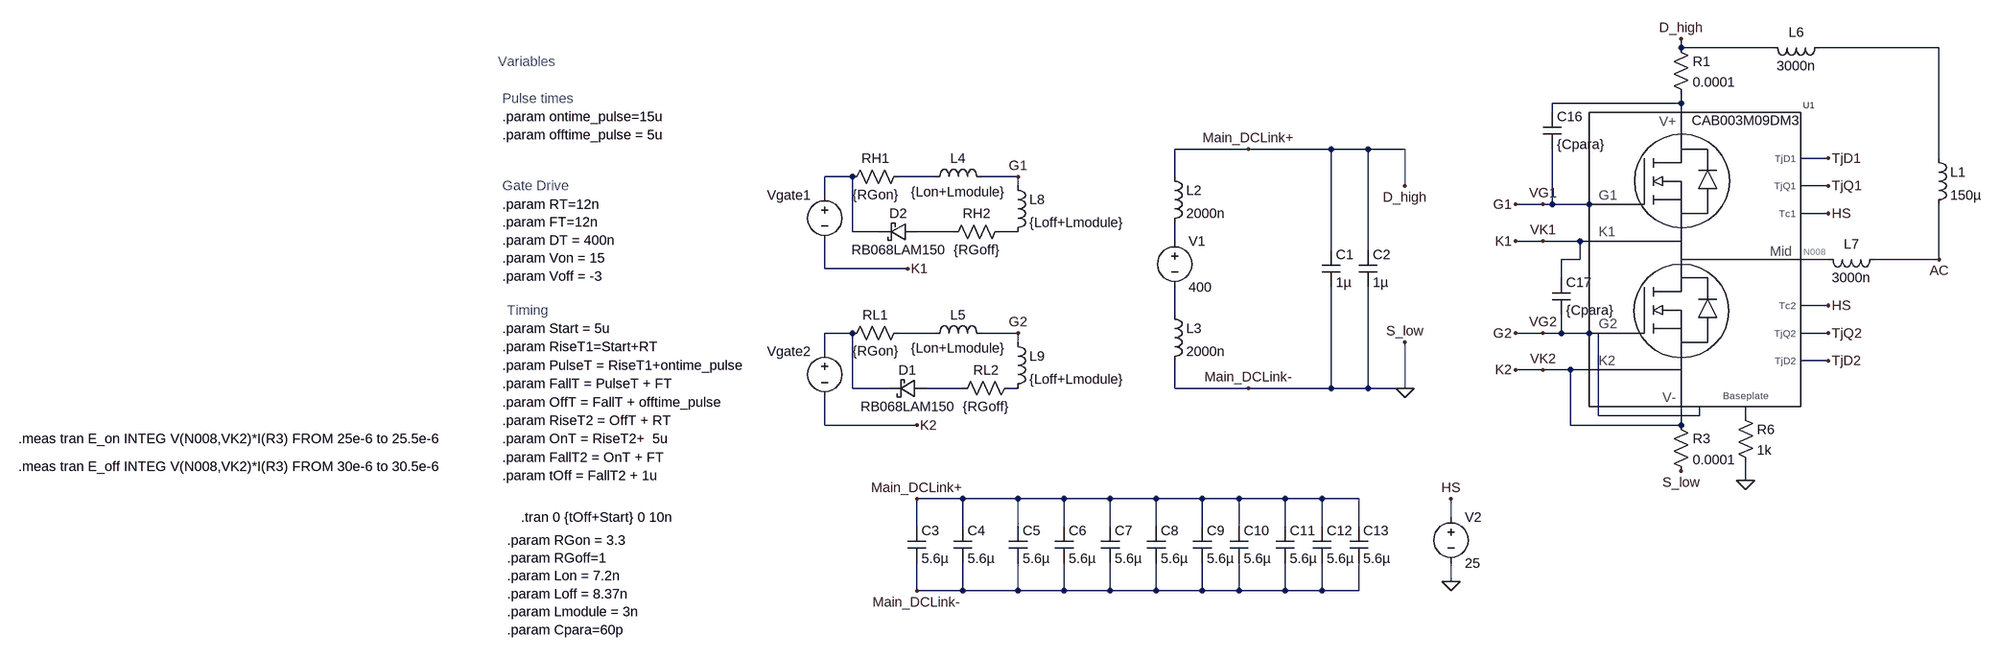
[diagram p0: schematic Inverter_DP.asc]
Inverter_DP.asc, the LTspice schematic file:
Version 4
SHEET 1 10008 968
WIRE 1088 -592 1088 -608
WIRE 1248 -592 1088 -592
WIRE 1536 -592 1328 -592
WIRE 1088 -496 1088 -512
WIRE 1088 -496 864 -496
WIRE 864 -480 864 -496
WIRE 1088 -480 1088 -496
WIRE 336 -416 208 -416
WIRE 480 -416 336 -416
WIRE 544 -416 480 -416
WIRE 608 -416 544 -416
WIRE 1344 -400 1296 -400
WIRE 1536 -400 1536 -592
WIRE -352 -368 -400 -368
WIRE -208 -368 -272 -368
WIRE -64 -368 -128 -368
WIRE 208 -368 208 -416
WIRE -64 -352 -64 -368
WIRE 608 -352 608 -416
WIRE 1344 -352 1296 -352
WIRE -400 -336 -400 -368
WIRE 848 -320 800 -320
WIRE 864 -320 864 -416
WIRE 864 -320 848 -320
WIRE 928 -320 864 -320
WIRE 960 -320 928 -320
WIRE 1344 -304 1296 -304
WIRE -352 -272 -352 -368
WIRE -304 -272 -352 -272
WIRE -176 -272 -240 -272
WIRE -64 -272 -96 -272
WIRE 208 -256 208 -288
WIRE 848 -256 800 -256
WIRE 912 -256 848 -256
WIRE 928 -256 912 -256
WIRE 480 -240 480 -416
WIRE 544 -240 544 -416
WIRE 912 -224 912 -256
WIRE 912 -224 880 -224
WIRE 1344 -224 1296 -224
WIRE 1536 -224 1536 -320
WIRE 1536 -224 1424 -224
WIRE -400 -208 -400 -256
WIRE -256 -208 -400 -208
WIRE 880 -192 880 -224
WIRE 1344 -144 1296 -144
WIRE 208 -128 208 -176
WIRE -352 -96 -400 -96
WIRE -208 -96 -272 -96
WIRE -64 -96 -128 -96
WIRE 848 -96 800 -96
WIRE 880 -96 880 -128
WIRE 880 -96 848 -96
WIRE 928 -96 880 -96
WIRE 944 -96 928 -96
WIRE 1344 -96 1296 -96
WIRE -64 -80 -64 -96
WIRE -400 -64 -400 -96
WIRE 1344 -48 1296 -48
WIRE 848 -32 800 -32
WIRE 896 -32 848 -32
WIRE 928 -32 896 -32
WIRE -352 0 -352 -96
WIRE -288 0 -352 0
WIRE -160 0 -224 0
WIRE -64 0 -80 0
WIRE 208 0 208 -48
WIRE 336 0 208 0
WIRE 480 0 480 -176
WIRE 480 0 336 0
WIRE 544 0 544 -176
WIRE 544 0 480 0
WIRE 608 0 608 -80
WIRE 608 0 544 0
WIRE 944 48 944 -96
WIRE 1120 48 1120 32
WIRE 1120 48 944 48
WIRE 1200 48 1200 32
WIRE -400 64 -400 16
WIRE -240 64 -400 64
WIRE 896 64 896 -32
WIRE 1088 64 1088 32
WIRE 1088 64 896 64
WIRE 1200 160 1200 128
WIRE -160 192 -240 192
WIRE -64 192 -160 192
WIRE 16 192 -64 192
WIRE 96 192 16 192
WIRE 176 192 96 192
WIRE 256 192 176 192
WIRE 320 192 256 192
WIRE 400 192 320 192
WIRE 464 192 400 192
WIRE 528 192 464 192
WIRE 688 224 688 192
WIRE -240 240 -240 192
WIRE -160 240 -160 192
WIRE -64 240 -64 192
WIRE 16 240 16 192
WIRE 96 240 96 192
WIRE 176 240 176 192
WIRE 256 240 256 192
WIRE 320 240 320 192
WIRE 400 240 400 192
WIRE 464 240 464 192
WIRE 528 240 528 192
WIRE 688 336 688 304
WIRE -240 352 -240 304
WIRE -160 352 -160 304
WIRE -160 352 -240 352
WIRE -64 352 -64 304
WIRE -64 352 -160 352
WIRE 16 352 16 304
WIRE 16 352 -64 352
WIRE 96 352 96 304
WIRE 96 352 16 352
WIRE 176 352 176 304
WIRE 176 352 96 352
WIRE 256 352 256 304
WIRE 256 352 176 352
WIRE 320 352 320 304
WIRE 320 352 256 352
WIRE 400 352 400 304
WIRE 400 352 320 352
WIRE 464 352 464 304
WIRE 464 352 400 352
WIRE 528 352 528 304
WIRE 528 352 464 352
FLAG 848 -320 VG1
FLAG 848 -96 VG2
FLAG -64 -368 G1
FLAG -64 -96 G2
FLAG -256 -208 K1
FLAG -240 64 K2
FLAG 800 -320 G1
FLAG 800 -96 G2
FLAG 848 -256 VK1
FLAG 848 -32 VK2
FLAG 800 -256 K1
FLAG 800 -32 K2
FLAG 1344 -352 TjQ1
FLAG 688 192 HS
FLAG 688 336 0
FLAG 1344 -144 HS
FLAG 1344 -304 HS
FLAG 1344 -96 TjQ2
FLAG 1344 -400 TjD1
FLAG 1344 -48 TjD2
FLAG 1200 160 0
FLAG 608 -80 S_low
FLAG 608 -352 D_high
FLAG 608 0 0
FLAG 1088 -608 D_high
FLAG 1088 144 S_low
FLAG 1536 -224 AC
FLAG -240 192 Main_DCLink+
FLAG -240 352 Main_DCLink-
FLAG 336 -416 Main_DCLink+
FLAG 336 0 Main_DCLink-
SYMBOL ind 1520 -416 R0
SYMATTR InstName L1
SYMATTR Value 150µ
SYMBOL res -256 -112 R90
WINDOW 0 0 56 VBottom 2
WINDOW 3 32 56 VTop 2
SYMATTR InstName RL1
SYMATTR Value {RGon}
SYMBOL res -256 -384 R90
WINDOW 0 0 56 VBottom 2
WINDOW 3 32 56 VTop 2
SYMATTR InstName RH1
SYMATTR Value {RGon}
SYMBOL voltage -400 -80 M0
WINDOW 123 0 0 Left 2
WINDOW 39 24 44 Left 2
WINDOW 3 -1448 60 Invisible 2
SYMATTR Value PWL(0u {Voff} {Start} {Voff} {RiseT1} {Von} {PulseT} {Von} {FallT} {Voff} {offT} {Voff} {RiseT2} {Von} {OnT} {Von} {FallT2} {Voff})
SYMATTR InstName Vgate2
SYMBOL voltage 208 -272 R0
WINDOW 123 0 0 Left 0
WINDOW 39 0 0 Left 0
SYMATTR InstName V1
SYMATTR Value 400
SYMBOL voltage 688 208 R0
SYMATTR InstName V2
SYMATTR Value 25
SYMBOL res 1184 32 R0
SYMATTR InstName R6
SYMATTR Value 1k
SYMBOL voltage -400 -352 M0
WINDOW 123 0 0 Left 2
WINDOW 39 24 44 Left 2
WINDOW 3 -1448 60 Invisible 2
SYMATTR Value PWL(0u {Voff} {Start+ontime_pulse+DT} {Voff} {FallT+DT} {Von} {RiseT2-DT} {Von} {RiseT2-DT+FT} {Voff} {FallT2+DT} {Voff} {FallT2+DT+RT} {Von})
SYMATTR InstName Vgate1
SYMBOL cap -256 240 R0
SYMATTR InstName C3
SYMATTR Value 5.6µ
SYMATTR SpiceLine V=500 Irms=6.8 Rser=12.7m Lser=17n
SYMBOL cap -176 240 R0
SYMATTR InstName C4
SYMATTR Value 5.6µ
SYMATTR SpiceLine V=500 Irms=6.8 Rser=12.7m Lser=17n
SYMBOL cap -80 240 R0
SYMATTR InstName C5
SYMATTR Value 5.6µ
SYMATTR SpiceLine V=500 Irms=6.8 Rser=12.7m Lser=17n
SYMBOL cap 0 240 R0
SYMATTR InstName C6
SYMATTR Value 5.6µ
SYMATTR SpiceLine V=500 Irms=6.8 Rser=12.7m Lser=17n
SYMBOL cap 80 240 R0
SYMATTR InstName C7
SYMATTR Value 5.6µ
SYMATTR SpiceLine V=500 Irms=6.8 Rser=12.7m Lser=17n
SYMBOL cap 160 240 R0
SYMATTR InstName C8
SYMATTR Value 5.6µ
SYMATTR SpiceLine V=500 Irms=6.8 Rser=12.7m Lser=17n
SYMBOL cap 240 240 R0
SYMATTR InstName C9
SYMATTR Value 5.6µ
SYMATTR SpiceLine V=500 Irms=6.8 Rser=12.7m Lser=17n
SYMBOL cap 304 240 R0
SYMATTR InstName C10
SYMATTR Value 5.6µ
SYMATTR SpiceLine V=500 Irms=6.8 Rser=12.7m Lser=17n
SYMBOL cap 384 240 R0
SYMATTR InstName C11
SYMATTR Value 5.6µ
SYMATTR SpiceLine V=500 Irms=6.8 Rser=12.7m Lser=17n
SYMBOL cap 448 240 R0
SYMATTR InstName C12
SYMATTR Value 5.6µ
SYMATTR SpiceLine V=500 Irms=6.8 Rser=12.7m Lser=17n
SYMBOL cap 512 240 R0
SYMATTR InstName C13
SYMATTR Value 5.6µ
SYMATTR SpiceLine V=500 Irms=6.8 Rser=12.7m Lser=17n
SYMBOL cap 464 -240 R0
SYMATTR InstName C1
SYMATTR Value 1µ
SYMATTR SpiceLine V=500 Irms=11.4 Rser=120m Lser=2.5n
SYMBOL cap 528 -240 R0
SYMATTR InstName C2
SYMATTR Value 1µ
SYMATTR SpiceLine V=500 Irms=11.4 Rser=120m Lser=2.5n
SYMBOL ind 192 -384 R0
SYMATTR InstName L2
SYMATTR Value 2000n
SYMBOL ind 192 -144 R0
SYMATTR InstName L3
SYMATTR Value 2000n
SYMBOL ind 1344 -608 R90
WINDOW 0 5 56 VBottom 2
WINDOW 3 32 56 VTop 2
SYMATTR InstName L6
SYMATTR Value 3000n
SYMBOL ind 1440 -240 R90
WINDOW 0 5 56 VBottom 2
WINDOW 3 32 56 VTop 2
SYMATTR InstName L7
SYMATTR Value 3000n
SYMBOL res 1072 48 R0
SYMATTR InstName R3
SYMATTR Value 0.0001
SYMBOL res -64 -16 R90
WINDOW 0 0 56 VBottom 2
WINDOW 3 32 56 VTop 2
SYMATTR InstName RL2
SYMATTR Value {RGoff}
SYMBOL res -80 -288 R90
WINDOW 0 0 56 VBottom 2
WINDOW 3 32 56 VTop 2
SYMATTR InstName RH2
SYMATTR Value {RGoff}
SYMBOL ind -224 -352 R270
WINDOW 0 32 56 VTop 2
WINDOW 3 5 56 VBottom 2
SYMATTR InstName L4
SYMATTR Value {Lon+Lmodule}
SYMBOL ind -224 -80 R270
WINDOW 0 32 56 VTop 2
WINDOW 3 5 56 VBottom 2
SYMATTR InstName L5
SYMATTR Value {Lon+Lmodule}
SYMBOL ind -80 -368 R0
SYMATTR InstName L8
SYMATTR Value {Loff+Lmodule}
SYMBOL ind -80 -96 R0
SYMATTR InstName L9
SYMATTR Value {Loff+Lmodule}
SYMBOL res 1072 -608 R0
SYMATTR InstName R1
SYMATTR Value 0.0001
SYMBOL schottky -224 -16 R90
WINDOW 0 0 32 VBottom 2
WINDOW 3 32 32 VTop 2
SYMATTR InstName D1
SYMATTR Value RB068LAM150
SYMATTR Description Diode
SYMATTR Type diode
SYMBOL schottky -240 -288 R90
WINDOW 0 0 32 VBottom 2
WINDOW 3 32 32 VTop 2
SYMATTR InstName D2
SYMATTR Value RB068LAM150
SYMATTR Description Diode
SYMATTR Type diode
SYMBOL cap 848 -480 R0
SYMATTR InstName C16
SYMATTR Value {Cpara}
SYMBOL cap 864 -192 R0
SYMATTR InstName C17
SYMATTR Value {Cpara}
SYMBOL CAB003M09DM3_LTspice 944 32 R0
SYMATTR InstName U1
TEXT -928 224 Left 2 !.tran 0 {tOff+Start} 0 10n
TEXT -960 152 Left 2 !.param tOff = FallT2 + 1u
TEXT -960 -104 Left 2 !.param Start = 5u
TEXT -960 -40 Left 2 !.param PulseT = RiseT1+ontime_pulse
TEXT -960 -8 Left 2 !.param FallT = PulseT + FT
TEXT -960 24 Left 2 !.param OffT = FallT + offtime_pulse
TEXT -960 56 Left 2 !.param RiseT2 = OffT + RT
TEXT -960 88 Left 2 !.param OnT = RiseT2+  5u
TEXT -960 120 Left 2 !.param FallT2 = OnT + FT
TEXT -960 -72 Left 2 !.param RiseT1=Start+RT
TEXT -952 -136 Left 2 ;Timing
TEXT -968 -568 Left 2 ;Variables
TEXT -960 -320 Left 2 !.param RT=12n\n.param FT=12n\n.param DT = 400n\n.param Von = 15\n.param Voff = -3
TEXT -960 -472 Left 2 !.param ontime_pulse=15u\n.param offtime_pulse = 5u
TEXT -960 -504 Left 2 ;Pulse times
TEXT -960 -352 Left 2 ;Gate Drive
TEXT -952 264 Left 2 !.param RGon = 3.3\n.param RGoff=1\n.param Lon = 7.2n\n.param Loff = 8.37n\n.param Lmodule = 3n\n.param Cpara=60p
TEXT -1936 88 Left 2 !.meas tran E_on INTEG V(N008,VK2)*I(R3) FROM 25e-6 to 25.5e-6
TEXT -1936 136 Left 2 !.meas tran E_off INTEG V(N008,VK2)*I(R3) FROM 30e-6 to 30.5e-6

The netlist it stands for:
* Inverter_DP.asc
L1 N001 AC 150µ
RL1 N011 N010 {RGon}
RH1 N004 N003 {RGon}
Vgate2 N010 VK2 PWL(0u {Voff} {Start} {Voff} {RiseT1} {Von} {PulseT} {Von} {FallT} {Voff} {offT} {Voff} {RiseT2} {Von} {OnT} {Von} {FallT2} {Voff})
V1 N007 N009 400
V2 HS 0 25
R6 N014 0 1k
Vgate1 N003 VK1 PWL(0u {Voff} {Start+ontime_pulse+DT} {Voff} {FallT+DT} {Von} {RiseT2-DT} {Von} {RiseT2-DT+FT} {Voff} {FallT2+DT} {Voff} {FallT2+DT+RT} {Von})
C3 Main_DCLink+ 0 5.6µ V=500 Irms=6.8 Rser=12.7m Lser=17n
C4 Main_DCLink+ 0 5.6µ V=500 Irms=6.8 Rser=12.7m Lser=17n
C5 Main_DCLink+ 0 5.6µ V=500 Irms=6.8 Rser=12.7m Lser=17n
C6 Main_DCLink+ 0 5.6µ V=500 Irms=6.8 Rser=12.7m Lser=17n
C7 Main_DCLink+ 0 5.6µ V=500 Irms=6.8 Rser=12.7m Lser=17n
C8 Main_DCLink+ 0 5.6µ V=500 Irms=6.8 Rser=12.7m Lser=17n
C9 Main_DCLink+ 0 5.6µ V=500 Irms=6.8 Rser=12.7m Lser=17n
C10 Main_DCLink+ 0 5.6µ V=500 Irms=6.8 Rser=12.7m Lser=17n
C11 Main_DCLink+ 0 5.6µ V=500 Irms=6.8 Rser=12.7m Lser=17n
C12 Main_DCLink+ 0 5.6µ V=500 Irms=6.8 Rser=12.7m Lser=17n
C13 Main_DCLink+ 0 5.6µ V=500 Irms=6.8 Rser=12.7m Lser=17n
C1 Main_DCLink+ 0 1µ V=500 Irms=11.4 Rser=120m Lser=2.5n
C2 Main_DCLink+ 0 1µ V=500 Irms=11.4 Rser=120m Lser=2.5n
L2 Main_DCLink+ N007 2000n
L3 N009 0 2000n
L6 N001 Main_DCLink+ 3000n
L7 AC N008 3000n
R3 VK2 0 0.0001
RL2 N013 N012 {RGoff}
RH2 N006 N005 {RGoff}
L4 N004 G1 {Lon+Lmodule}
L5 N011 G2 {Lon+Lmodule}
L8 G1 N006 {Loff+Lmodule}
L9 G2 N013 {Loff+Lmodule}
R1 Main_DCLink+ N002 0.0001
D1 N012 N010 RB068LAM150
D2 N005 N003 RB068LAM150
C16 N002 G1 {Cpara}
C17 VK1 G2 {Cpara}
XU1 N002 N008 VK2 G1 VK1 G2 VK2 HS HS TjQ1 TjQ2 TjD1 TjD2 N014 CAB003M09DM3 Thermals=1 BPC=0 level=3 Rp=100  ; pins V+ Mid V- G1 K1 G2 K2 Tc1 Tc2 TjQ1 TjQ2 TjD1 TjD2 Baseplate
.model D D
.lib standard.dio
.tran 0 {tOff+Start} 0 10n
.param tOff = FallT2 + 1u
.param Start = 5u
.param PulseT = RiseT1+ontime_pulse
.param FallT = PulseT + FT
.param OffT = FallT + offtime_pulse
.param RiseT2 = OffT + RT
.param OnT = RiseT2+  5u
.param FallT2 = OnT + FT
.param RiseT1=Start+RT
* Timing
* Variables
.param RT=12n
.param FT=12n
.param DT = 400n
.param Von = 15
.param Voff = -3
.param ontime_pulse=15u
.param offtime_pulse = 5u
* Pulse times
* Gate Drive
.param RGon = 3.3
.param RGoff=1
.param Lon = 7.2n
.param Loff = 8.37n
.param Lmodule = 3n
.param Cpara=60p
.meas tran E_on INTEG V(N008,VK2)*I(R3) FROM 25e-6 to 25.5e-6
.meas tran E_off INTEG V(N008,VK2)*I(R3) FROM 30e-6 to 30.5e-6
.lib WS_HalfBridge.lib
.backanno
.end